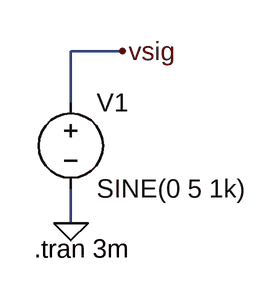
[diagram p0: schematic aula1.9.asc]
aula1.9.asc, the LTspice schematic file:
Version 4
SHEET 1 880 680
WIRE 96 96 48 96
WIRE 48 144 48 96
WIRE 48 256 48 224
FLAG 96 96 vsig
FLAG 48 256 0
SYMBOL voltage 48 128 R0
WINDOW 123 0 0 Left 0
WINDOW 39 0 0 Left 0
SYMATTR InstName V1
SYMATTR Value SINE(0 5 1k)
TEXT 14 280 Left 2 !.tran 3m

The netlist it stands for:
* aula1.9.asc
V1 vsig 0 SINE(0 5 1k)
.tran 3m
.backanno
.end